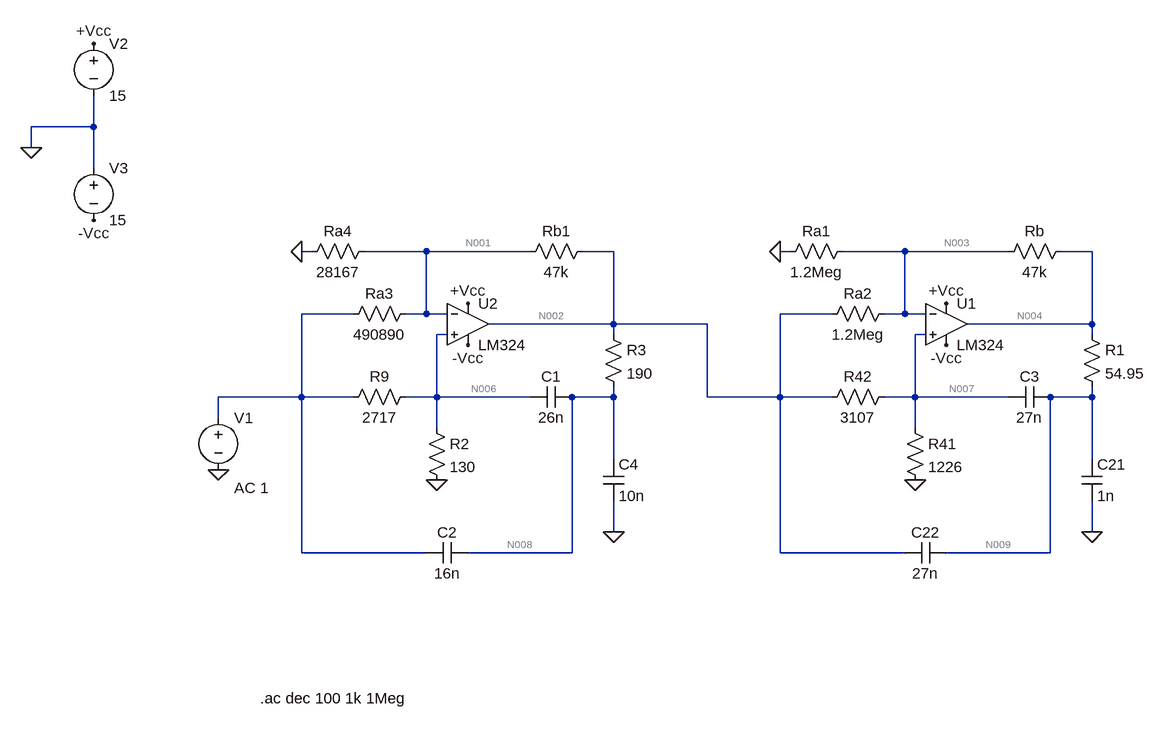
[diagram p0: schematic Sedra_complete_Test3.asc]
* Sedra_complete_Test3.asc
V1 N005 0 AC 1
R42 N007 N002 3107
Ra2 N003 N002 1.2Meg
* U1: LM324 (symbol sympropio\LM324 not available, pins judged from their places): In+=N007 In-=N003 V+=+Vcc V-=-Vcc OUT=N004
R41 N007 0 1226
C3 N009 N007 27n
C22 N009 N002 27n
Ra1 N003 0 1.2Meg
Rb N004 N003 47k
C21 N009 0 1n
V2 +Vcc 0 15
V3 0 -Vcc 15
R9 N006 N005 2717
Ra3 N001 N005 490890
* U2: LM324 (symbol sympropio\LM324 not available, pins judged from their places): In+=N006 In-=N001 V+=+Vcc V-=-Vcc OUT=N002
R2 N006 0 130
C1 N008 N006 26n
C2 N008 N005 16n
Ra4 N001 0 28167
Rb1 N002 N001 47k
C4 N008 0 10n
R1 N004 N009 54.95
R3 N002 N008 190
.ac dec 100 1k 1Meg
.backanno
.end

* Results of the author's LTspice run, read from the files saved beside the schematic
* Operating Point, zero values left out:
*   V(n007) = -272 µV
*   V(n002) = -1.023 mV
*   V(n003) = -305.6 µV
*   V(n004) = -1.226 mV
*   V(-vcc) = -15 V
*   V(+vcc) = 15 V
*   V(n009) = -1.226 mV
*   V(n006) = 2.471 µV
*   V(n001) = -31.17 µV
*   V(n008) = -1.023 mV
*   I(Rb1) = -21.1 nA
*   I(Ra4) = -1.107 nA
*   I(R2) = 19.01 nA
*   I(Ra3) = -63.51 pA
*   I(R9) = 909.5 pA
*   I(Rb) = -19.59 nA
*   I(Ra1) = -254.7 pA
*   I(R41) = -221.8 nA
*   I(Ra2) = 597.9 pA
*   I(R42) = 241.8 nA
*   I(V3) = -1.999 mA
*   I(V2) = -2 mA
*   I(V1) = 846 pA
*   Ix(u1:1) = -19.92 nA
*   Ix(u1:2) = -19.93 nA
*   Ix(u1:3) = 999.8 µA
*   Ix(u1:4) = -999.7 µA
*   Ix(u1:5) = 19.59 nA
*   Ix(u2:1) = -19.92 nA
*   Ix(u2:2) = -19.93 nA
*   Ix(u2:3) = 999.8 µA
*   Ix(u2:4) = -999.7 µA
*   Ix(u2:5) = 263.5 nA
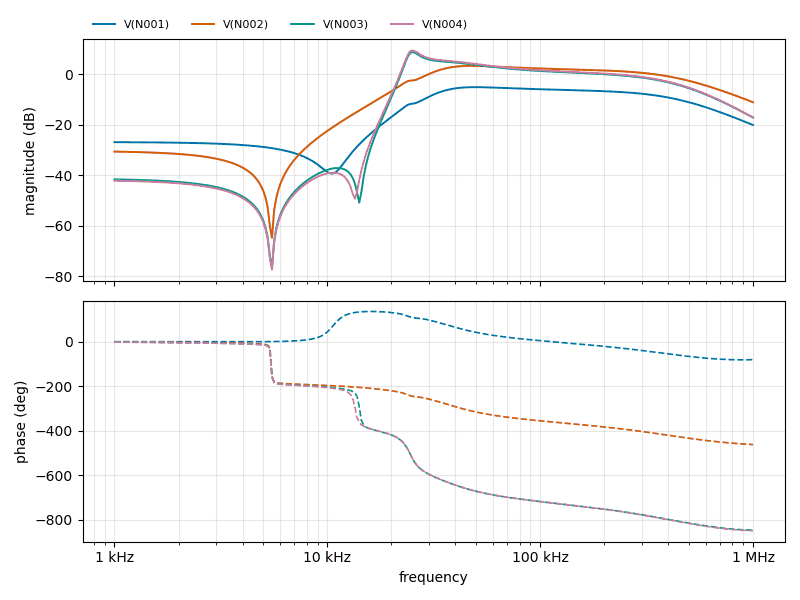
[diagram p1: AC Analysis of Sedra_complete_Test3.asc, plotted from the saved traces]
* AC Analysis, 1 run:
*   V(N001): -26.88 dB at 1 kHz, -20.08 dB at 1 MHz, peak -5.09 dB at 50.12 kHz, 3 dB below the peak at 31.41 kHz and 330.2 kHz
*   V(N002): -30.61 dB at 1 kHz, -11.08 dB at 1 MHz, peak 3.35 dB at 47.86 kHz, 3 dB below the peak at 30.47 kHz and 320 kHz
*   V(N003): -41.61 dB at 1 kHz, -17.13 dB at 1 MHz, peak 8.82 dB at 25.12 kHz, 3 dB below the peak at 23.54 kHz and 30.16 kHz
*   V(N004): -42.15 dB at 1 kHz, -17.13 dB at 1 MHz, peak 9.46 dB at 25.12 kHz, 3 dB below the peak at 23.51 kHz and 29.76 kHz